# Altium schematic sheet Main.SchDoc: MoonPilot - Barometer
size A3; DrawnBy: Máni Magnússon; Revision: A
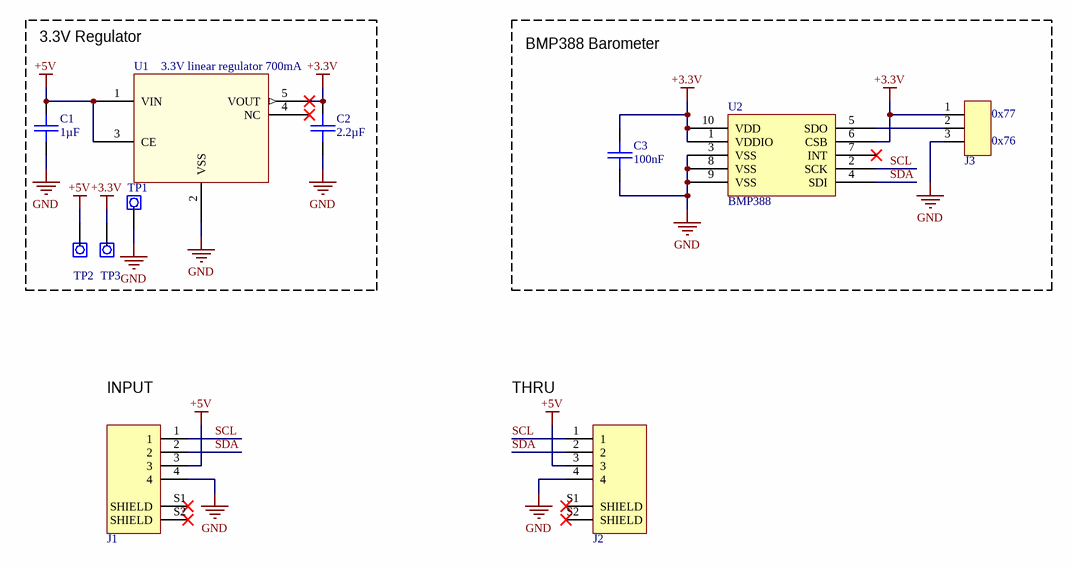
[diagram p0: Main.SchDoc]

## Parts
C1  1µF  [0603_CAP]
C2  2.2µF  [0603_CAP]
C3  100nF  [0603_CAP]
J1  4 pin vertical JST GH  [JST_BM04B-GHS-TBT(LF)(SN)(N)]  (value not drawn)
J2  4 pin vertical JST GH  [JST_BM04B-GHS-TBT(LF)(SN)(N)]  (value not drawn)
J3  Generic 3 pin 100 mil header  [HEADER-3-POS_100_mil]  (value not drawn)
TP1  GND  [Testpoint2]  (value not drawn)
TP2  5V  [Testpoint2]  (value not drawn)
TP3  3.3V  [Testpoint2]  (value not drawn)
U1  3.3V linear regulator 700mA  [SOT-25_TOR]
U2  BMP388  [QFN_BMP388_BOS]

## Blocks framed on the sheet
3.3V Regulator: C1 C2 TP1-TP3 U1
BMP388 Barometer: C3 J3 U2

## Nets
+3.3V: C2.1 C3.1 J3.1 TP3.1 U1.5(VOUT) U2.1(VDDIO) U2.6(CSB) U2.10(VDD)
+5V: C1.1 J1.3 J2.3 TP2.1 U1.1(VIN) U1.3(CE)
GND: C1.2 C2.2 C3.2 J1.4 J2.4 J3.3 TP1.1 U1.2(VSS) U2.3(VSS) U2.8(VSS) U2.9(VSS)
SCL: J1.1 J2.1 U2.2(SCK)
SDA: J1.2 J2.2 U2.4(SDI)
NetJ3_2: J3.2 U2.5(SDO)

Not connected (* = marked no-connect by the designer): J1 S1(SHIELD)* S2(SHIELD)*; J2 S1(SHIELD)* S2(SHIELD)*; U1 4(NC)*; U2 7(INT)*

## Notes on the sheet
- (near J3) 0x76
- (near J3) 0x77
- (near J1) INPUT
- THRU
- Sheet title:
- Revision:
- Drawn by:
- Date:
- File:

## Library data of the parts
C1-C3 = Capacitor
J1 J2 = BM04B-GHS-TBT(LF)(SN)(N): JST GH vertical 4 pin / DigiKey part no. 455-1580-1-ND; MF: JST Sales; MP: BM04B-GHS-TBT_LF__SN__N_; SnapEDA_Link: https://www.snapeda.com/parts/BM04B-GHS-TBT%28LF%29%28SN%29%28N%29/JST%20Sales%20America%20Inc./view-part/841999/?ref=snap; Digi-Key_Part_Number: 455-1580-1-ND; Digi-Key_Purchase_URL: https://www.digikey.com/product-detail/en/jst-sales-america-inc/BM04B-GHS-TBT_LF__SN__N_/455-1580-1-ND/807848?utm_source=snapeda&utm_medium=aggregator&utm_campaign=symbol; Value: *; Package: None
J3 = 3 pin 100 mil header
TP1-TP3 = Testpoint
U1 = XC6222B331MR-G: Digikey part no. 893-1143-1-ND; Vendor: Torex Semiconductor; Built_By: EMA_UL_Team; SourceLibrary: Torex_2016-07-11_1; Manufacturer_Part_Number: XC6222B331MR-G; Copyright: Copyright (C) 2018 Accelerated Designs. All rights reserved; RefDes: RefDes; Type: DEV
U2 = BMP388: No Description Available; Vendor: Bosch; SourceLibrary: Bosch_2019-11-06; Manufacturer_Part_Number: BMP388; Copyright: Copyright (C) 2018 Accelerated Designs. All rights reserved; RefDes: RefDes; Type: DEV